# EAGLE design GEF-USB-B (EAGLE 6.4)
CHECKED: R. STARR; COMPANY: RTZ Audio; DATABASE: .\BOM\GEF-USB-PARTSDB.TXT; DATE: XX/XX/XX; DRAWN: R. STARR; DRGNO: ED-2XXX.100; REV: B
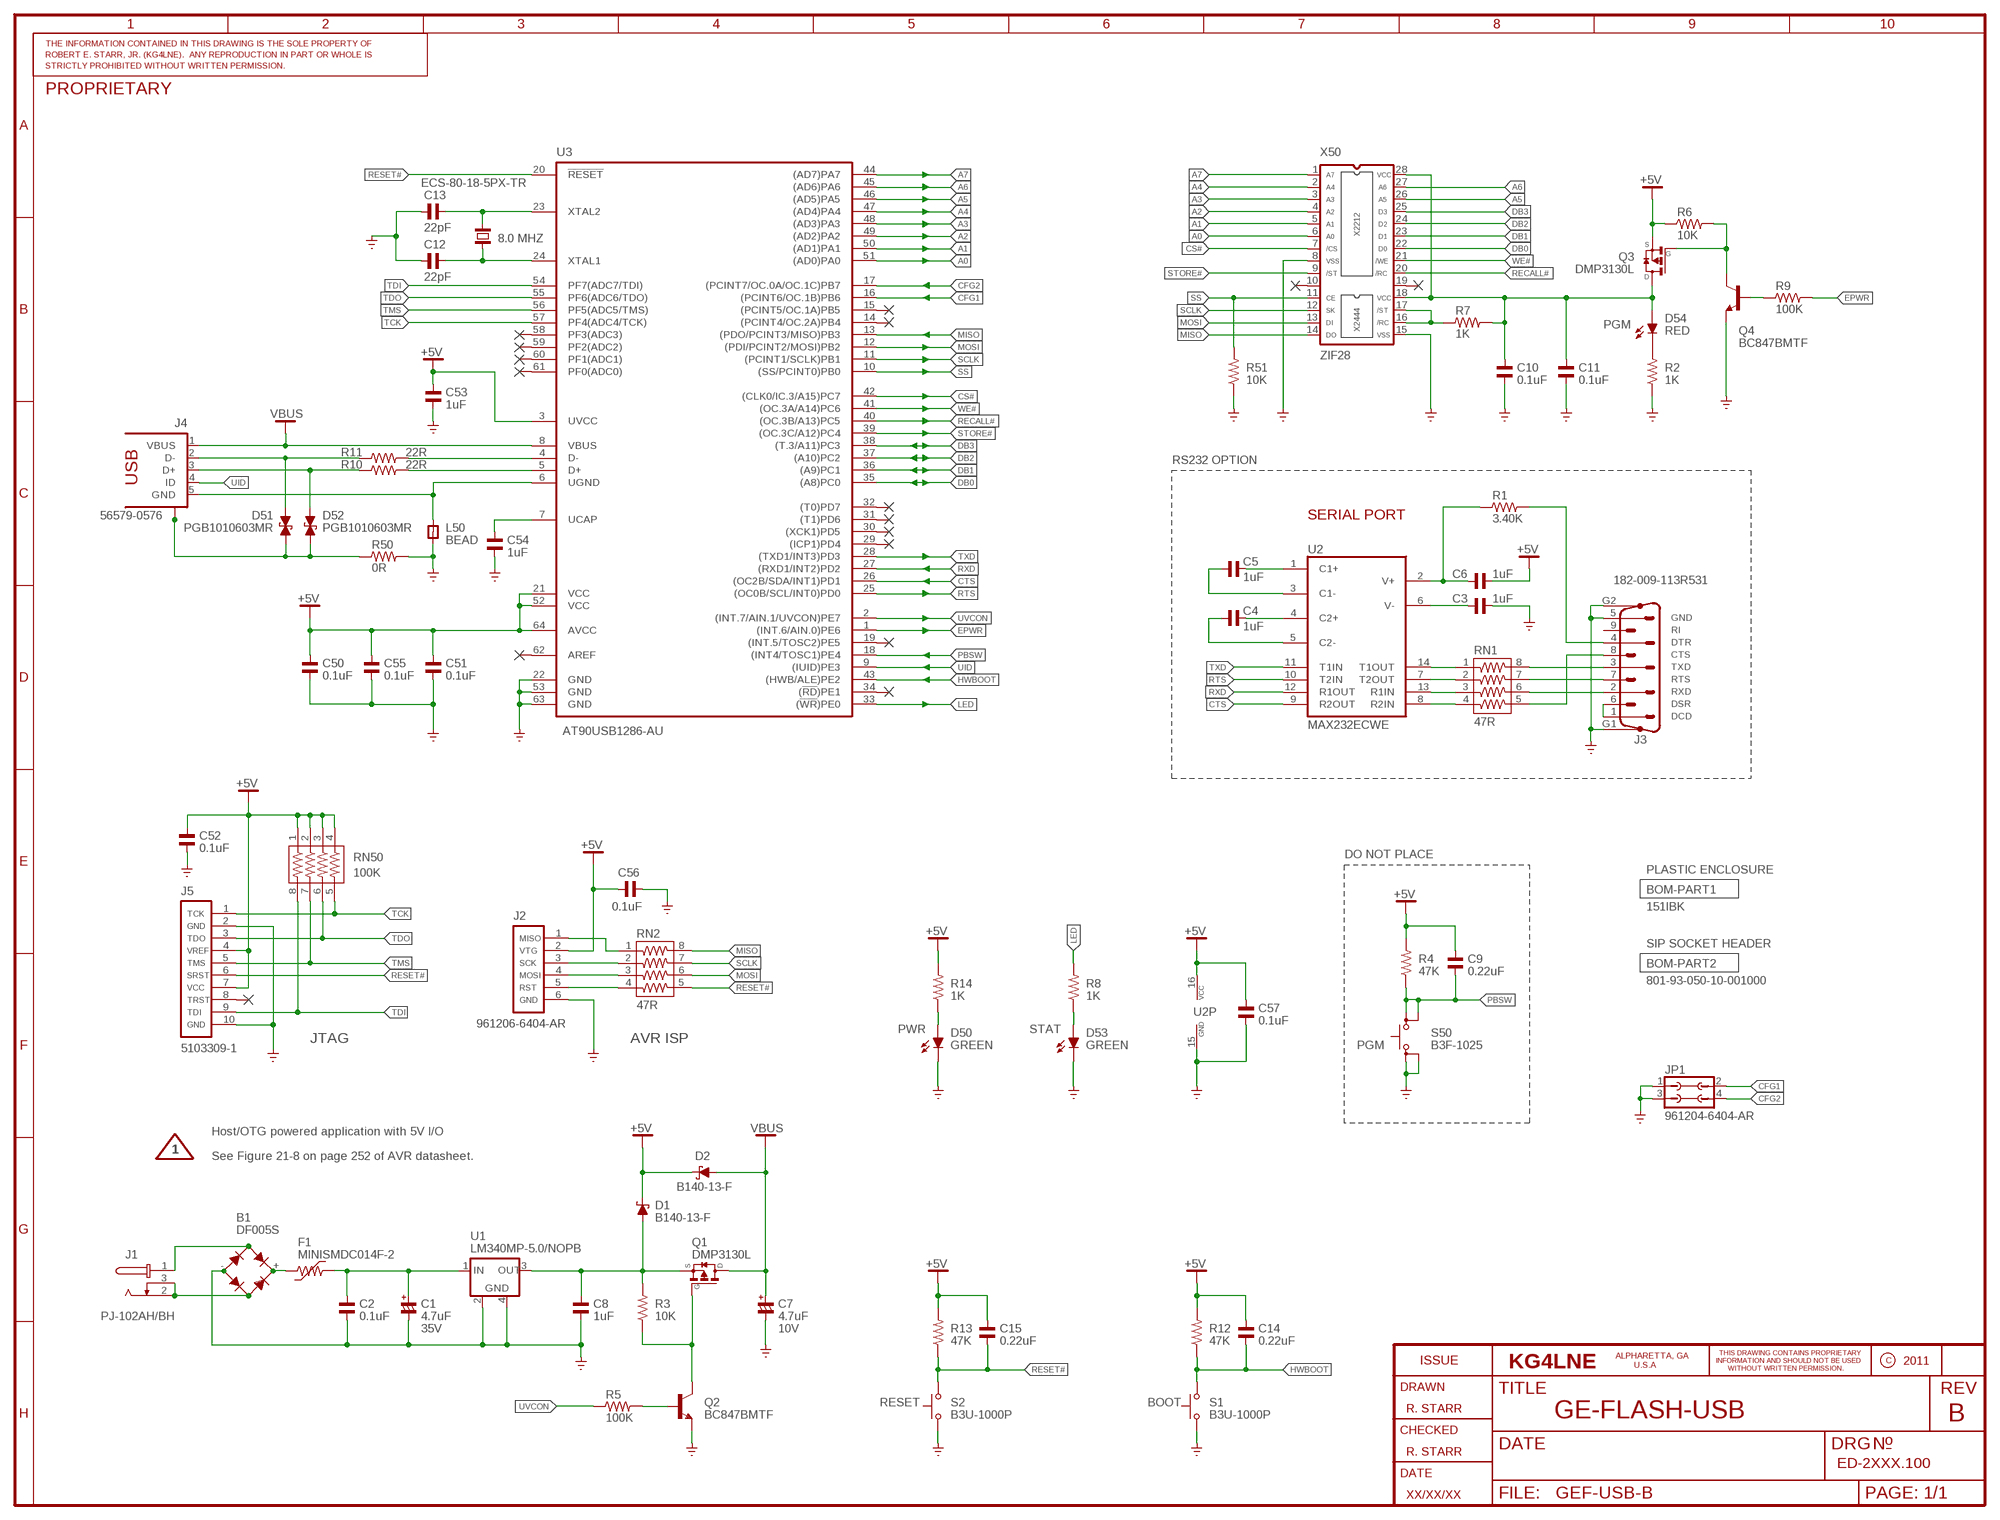
[diagram p0: schematic, sheet 1]
BOM-PART1 (BOM-PART): BOM: INCLUDE; DESC: PLASTIC ENCLOSURE; PARTNO: 151IBK; QTY: 1
BOM-PART2 (BOM-PART): BOM: INCLUDE; DESC: SIP SOCKET HEADER; PARTNO: 801-93-050-10-001000; QTY: 1
JMP1 (JUMP-Q): BOM: EXCLUDE; PARTNO: *
JMP2 (JUMP-Q): BOM: EXCLUDE; PARTNO: *

## Parts
B1  DF005S  DF-S  [DF-S]
C1  4.7uF  CP_7343  [C7343/T]
C2  0.1uF  C_0805  [C0805]
C3  1uF  C_0805  [C0805]
C4  1uF  C_0805  [C0805]
C5  1uF  C_0805  [C0805]
C6  1uF  C_0805  [C0805]
C7  4.7uF  CP_3528  [C3528/T]
C8  1uF  C_0805  [C0805]
C9  0.22uF  C_0805  [C0805]
C10  0.1uF  C_0805  [C0805]
C11  0.1uF  C_0805  [C0805]
C12  22pF  C_0805  [C0805]
C13  22pF  C_0805  [C0805]
C14  0.22uF  C_0805  [C0805]
C15  0.22uF  C_0805  [C0805]
C50  0.1uF  C_0805  [C0805]
C51  0.1uF  C_0805  [C0805]
C52  0.1uF  C_0805  [C0805]
C53  1uF  C_0805  [C0805]
C54  1uF  C_0805  [C0805]
C55  0.1uF  C_0805  [C0805]
C56  0.1uF  C_0805  [C0805]
C57  0.1uF  C_0805  [C0805]
D1  B140-13-F  DIODE-SCHOTTKY-SMA  [SMA]
D2  B140-13-F  DIODE-SCHOTTKY-SMA  [SMA]
D50  GREEN  LED3MM  [LED3MM]
D51  PGB1010603MR  PGB-0603  [PGB-0603]
D52  PGB1010603MR  PGB-0603  [PGB-0603]
D53  GREEN  LED3MM  [LED3MM]
D54  RED  LED3MM  [LED3MM]
F1  MINISMDC014F-2  POLYSWITCH-F1812  [F1812]
J1  PJ-102AH/BH  [PJ-102XH]
J2  961206-6404-AR  AVR-ISP6-MA03-2  [HDR-MA03-2]
J3  182-009-113R531  NC182M9-VS  [NC182M9]
J4  56579-0576  [56579-0576]
J5  5103309-1  AVR-JTAG10-5103309-1  [HDR-5103309-1]
JP1  961204-6404-AR  JP2Q  [JP2Q]
L50  BEAD  FB_0805  [L0805]
Q1  DMP3130L  [SOT23]
Q2  BC847BMTF  BC847BSMD  [SOT23]
Q3  DMP3130L  [SOT23]
Q4  BC847BMTF  BC847BSMD  [SOT23]
R1  3.40K  R_0805  [R0805]
R2  1K  R_0805  [R0805]
R3  10K  R_0805  [R0805]
R4  47K  R_0805  [R0805]
R5  100K  R_0805  [R0805]
R6  10K  R_0805  [R0805]
R7  1K  R_0805  [R0805]
R8  1K  R_0805  [R0805]
R9  100K  R_0805  [R0805]
R10  22R  R_0805  [R0805]
R11  22R  R_0805  [R0805]
R12  47K  R_0805  [R0805]
R13  47K  R_0805  [R0805]
R14  1K  R_0805  [R0805]
R50  0R  R_0805  [R0805]
R51  10K  R_0805  [R0805]
RN1  47R  744-8  [744-8]
RN2  47R  744-8  [744-8]
RN50  100K  744-8  [744-8]
S1  B3U-1000P  [B3U-1000P]
S2  B3U-1000P  [B3U-1000P]
S50  B3F-1025  10-XX-B  [B3F-10XX-B]
U1  LM340MP-5.0/NOPB  LM340MP-5.0  [SOT223]
U2  MAX232ECWE  [SO16W]
U3  AT90USB1286-AU  AT90USB646/647/1286/1287-MD  [TQFP64A]
X50  ZIF28  [ZIF28]
Y1  8.0 MHZ  CRYTALHC49UP  [HC49UP]

## Nets
+5V: C6.1 C9.2 C14.2 C15.2 C50.1 C51.2 C52.1 C53.2 C55.1 C56.2 C57.1 D1.C D2.C J2.2 J5.4 J5.7 Q3.2(S) R4.2 R6.1 R12.2 R13.2 R14.2 RN50.1 RN50.2 RN50.3 RN50.4 U2.16(VCC) U3.3(UVCC) U3.21(VCC) U3.52(VCC) U3.64(AVCC)
A0: U3.51((AD0)PA0) X50.6
A1: U3.50((AD1)PA1) X50.5
A2: U3.49((AD2)PA2) X50.4
A3: U3.48((AD3)PA3) X50.3
A4: U3.47((AD4)PA4) X50.2
A5: U3.46((AD5)PA5) X50.26
A6: U3.45((AD6)PA6) X50.27
A7: U3.44((AD7)PA7) X50.1
CFG1: JP1.2 U3.16((PCINT6/OC.1B)PB6)
CFG2: JP1.4 U3.17((PCINT7/OC.0A/OC.1C)PB7)
CS#: U3.42((CLK0/IC.3/A15)PC7) X50.7
CTS: U2.9(R2OUT) U3.26((OC2B/SDA/INT1)PD1)
DB0: U3.35((A8)PC0) X50.22
DB1: U3.36((A9)PC1) X50.23
DB2: U3.37((A10)PC2) X50.24
DB3: U3.38((T.3/A11)PC3) X50.25
EPWR: R9.2 U3.1((INT.6/AIN.0)PE6)
GND: B1.- C1.- C2.1 C3.1 C7.- C8.2 C10.1 C11.1 C12.1 C13.1 C50.2 C51.1 C52.2 C53.1 C54.1 C55.2 C56.1 C57.2 D50.K(C) D53.K(C) J2.6 J3.5 J3.G1 J3.G2 J5.2 J5.10 JP1.1 JP1.3 L50.1 Q2.2(E) Q4.2(E) R2.1 R50.2 R51.1 S1.1(P) S2.1(P) S50.3(P) S50.4(P1) U1.2(GND) U1.4(GND1) U2.15(GND) U3.22(GND) U3.53(GND) U3.63(GND) X50.8 X50.15 ; supply symbol labelled GND_
HWBOOT: C14.1 R12.1 S1.2(S) U3.43((HWB/ALE)PE2)
LED: R8.2 U3.33((!WR!)PE0)
MISO: RN2.8 U3.13((PDO/PCINT3/MISO)PB3) X50.14
MOSI: RN2.6 U3.12((PDI/PCINT2/MOSI)PB2) X50.13
N$1: J2.5 RN2.4
N$2: B1.AC2(A2) J1.2(S) J1.3(SS)
N$3: R10.2 U3.5(D+)
N$4: D52.2 J4.3(D+) R10.1
N$5: R11.2 U3.4(D-)
N$6: D51.2 J4.2(D-) R11.1
N$7: C54.2 U3.7(UCAP)
N$8: D50.A R14.1
N$9: D51.1 D52.1 J4.S1 J4.S2 J4.S3 J4.S4 R50.1
N$10: D53.A R8.1
N$11: Q1.1(G) Q2.3(C) R3.1
N$12: Q2.1(B) R5.2
N$14: Q3.1(G) Q4.3(C) R6.2
N$15: C10.2 C11.2 D54.A Q3.3(D) R7.2 X50.18 X50.28
N$17: D54.K(C) R2.2
N$18: J4.5(GND) L50.2 U3.6(UGND)
N$19: J3.1 J3.6
N$20: C1.+ C2.2 F1.2 U1.1(IN)
N$21: C8.1 D1.A Q1.2(S) R3.2 U1.3(OUT)
N$22: J3.2 RN1.6
N$23: B1.+ F1.1
N$24: B1.AC1(A1) J1.1(T)
N$25: Q4.1(B) R9.1
N$30: C12.2 U3.24(XTAL1) Y1.1
N$31: J3.7 RN1.7
N$34: C3.2 U2.6(V-)
N$36: C6.2 R1.1 U2.2(V+)
N$38: C13.2 U3.23(XTAL2) Y1.2
N$39: C4.1 U2.4(C2+)
N$44: C5.1 U2.1(C1+)
N$45: C4.2 U2.5(C2-)
N$46: C5.2 U2.3(C1-)
N$51: J3.8 RN1.5
N$71: J3.3 RN1.8
N$74: RN1.3 U2.13(R1IN)
N$75: RN1.1 U2.14(T1OUT)
N$101: RN1.4 U2.8(R2IN)
N$103: J3.4 R1.2
N$104: RN1.2 U2.7(T2OUT)
N$105: J2.1 RN2.1
N$107: J2.3 RN2.2
N$108: J2.4 RN2.3
PBSW: C9.1 R4.1 S50.1(S) S50.2(S1) U3.18((INT4/TOSC1)PE4)
PU2: R7.1 X50.16 X50.17
RECALL#: U3.40((OC.3B/A13)PC5) X50.20
RESET#: C15.1 J5.6 R13.1 RN2.5 S2.2(S) U3.20(!RESET!)
RTS: U2.10(T2IN) U3.25((OC0B/SCL/INT0)PD0)
RXD: U2.12(R1OUT) U3.27((RXD1/INT2)PD2)
SCLK: RN2.7 U3.11((PCINT1/SCLK)PB1) X50.12
SS: R51.2 U3.10((SS/PCINT0)PB0) X50.11
STORE#: U3.39((OC.3C/A12)PC4) X50.9
TCK: J5.1 RN50.5 U3.57(PF4(ADC4/TCK))
TDI: J5.9 RN50.8 U3.54(PF7(ADC7/TDI))
TDO: J5.3 RN50.6 U3.55(PF6(ADC6/TDO))
TMS: J5.5 RN50.7 U3.56(PF5(ADC5/TMS))
TXD: U2.11(T1IN) U3.28((TXD1/INT3)PD3)
UID: J4.4(ID) U3.9((IUID)PE3)
UVCON: R5.1 U3.2((INT.7/AIN.1/UVCON)PE7)
VBUS: C7.+ D2.A J4.1(VBUS) Q1.3(D) U3.8(VBUS)
WE#: U3.41((OC.3A/A14)PC6) X50.21
Unconnected: J3.9 J5.8 U3.14((PCINT4/OC.2A)PB4) U3.15((PCINT5/OC.1A)PB5) U3.19((INT.5/TOSC2)PE5) U3.29((ICP1)PD4) U3.30((XCK1)PD5) U3.31((T1)PD6) U3.32((T0)PD7) U3.34((!RD!)PE1) U3.58(PF3(ADC3)) U3.59(PF2(ADC2)) U3.60(PF1(ADC1)) U3.61(PF0(ADC0)) U3.62(AREF) X50.10 X50.19

## Notes on the sheet
- A7 | VCC
- A4 | A6
- A3 | A5
- A2 | D3
- A1 | D2
- X2212
- A0 | D1
- /CS | D0
- VSS | /WE
- /ST | /RC
- CE | VCC
- SK | /ST
- DI | /RC
- X2444
- DO | VSS
- RS232 OPTION
- SERIAL PORT
- GND
- RI
- DTR
- CTS
- TXD
- RTS
- RXD
- DSR
- DCD
- DO NOT PLACE
- JTAG | AVR ISP
- Host/OTG powered application with 5V I/O
- See Figure 21-8 on page 252 of AVR datasheet.
- GE-FLASH-USB

## Library data of the parts
B1 = rectifier:DF-S: RECTIFIER DF005S - DF10S, Diodes Inc.; PARTNO: DF005S
C1 = rc-master:CP_: POLARIZED CAP; PARTNO: TAJD475M035RNJ; VOLT: 35V
C2 C10 C11 C50-C52 C55-C57 = rc-master:C_: NON-POLARIZED CAP; PARTNO: GCM21BR72A104KA37L
C3-C6 C8 C53 C54 = rc-master:C_: NON-POLARIZED CAP; PARTNO: GCM21BR71E105KA56L
C7 = rc-master:CP_: POLARIZED CAP; PARTNO: TAJB475K010RNJ; VOLT: 10V
C9 = rc-master:C_: NON-POLARIZED CAP; DNP: T; PARTNO: GCM21BR71H224KA37L
C12 C13 = rc-master:C_: NON-POLARIZED CAP; PARTNO: GRM2195C2A220JZ01D
C14 C15 = rc-master:C_: NON-POLARIZED CAP; PARTNO: GCM21BR71H224KA37L
D1 D2 = diode:DIODE-SCHOTTKY-: SCHOTTKY DIODE; PARTNO: B140-13-F
D50 = LED:LED: LED Various Types; LABEL: PWR; PARTNO: TLHG4405
D51 D52 = diode:PGB-0603: ESD SUPPRESSOR; PARTNO: PGB1010603MR
D53 = LED:LED: LED Various Types; LABEL: STAT; PARTNO: TLHG4405
D54 = LED:LED: LED Various Types; LABEL: PGM; PARTNO: TLHR4405
F1 = fuse:POLYSWITCH: POLYSWITCH Polyswitch Resetable Fuses; PARTNO: MINISMDC014F-2
J1 = con-cuistack:PJ-102AH/BH: DC Power Jack PJ-102AH (2.1 x 5.5 MM) PJ-102BH (2.5 x 5.5 MM); PARTNO: PJ-102AH
J2 = atmel-avr:AVR-ISP6-: AVR ISP-6 Serial Programming Header; PARTNO: 961206-6404-AR
J3 = con-subd:NC182M9-VS: SUB-D MALE - NorComp; PARTNO: 182-009-113R531
J4 = con-usb:56579-0576: USB - OTG, miniUSB Type AB, Molex; PARTNO: 56579-0576
J5 = atmel-avr:AVR-JTAG10-: AVR JTAG Debug/Programming Header; PARTNO: 5103309-1
JP1 = jumper:JP2Q: JUMPER; PARTNO: 961204-6404-AR
L50 = rc-master:FB_: FERRITE BEAD; PARTNO: BLM21PG221SN1D
Q1 Q3 = transistor-fet:DMP3130L: P-CHANNEL ENHANCEMENT MODE MOSFET; PARTNO: DMP3130L
Q2 Q4 = transistor-npn:BC847*: NPN Transistor; PARTNO: BC847BMTF
R1 = rc-master:R_: RESISTOR; PARTNO: ERJ-6ENF3401V
R2 R7 R8 R14 = rc-master:R_: RESISTOR; PARTNO: ERJ-6ENF1001V
R3 R6 R51 = rc-master:R_: RESISTOR; PARTNO: ERJ-6ENF1022V
R4 = rc-master:R_: RESISTOR; DNP: T; PARTNO: ERJ-6ENF4702V
R5 R9 = rc-master:R_: RESISTOR; PARTNO: ERJ-6ENF1003V
R10 R11 = rc-master:R_: RESISTOR; PARTNO: ERJ-6ENF22R1V
R12 R13 = rc-master:R_: RESISTOR; PARTNO: ERJ-6ENF4702V
R50 = rc-master:R_: RESISTOR; PARTNO: ERJ-6GEY0R00V
RN1 RN2 = resistor-array:744-8: CTS 744 Series 4 Resistors, 8 Terminations; PARTNO: 744C083470JTR
RN50 = resistor-array:744-8: CTS 744 Series 4 Resistors, 8 Terminations; PARTNO: 744C083104JPTR
S1 = switch-omron:B3U-1000P: SMD Tactile Switch - Ultra Small; LABEL: BOOT; PARTNO: B3U-1000P
S2 = switch-omron:B3U-1000P: SMD Tactile Switch - Ultra Small; LABEL: RESET; PARTNO: B3U-1000P
S50 = switch-omron:10-XX: OMRON SWITCH; DNP: T; LABEL: PGM; PARTNO: B3F-1025
U1 = v-reg:LM340MP-5.0: VOLTAGE REGULATOR; PARTNO: LM340MP-5.0/NOPB
U2 = maxim:MAX232ECWE: RS232 TRANSEIVER; PARTNO: MAX232ECWE+
U3 = atmel-avr:AT90USB646/647/1286/1287: MICROCONTROLLER 64/128K Bytes of ISP Flash and USB Controller; PARTNO: AT90USB1286-AU
X50 = CUSTOM:ZIF28: ZIF Socket - 28 Pin; PARTNO: 28-6554-11
Y1 = crystal:CRYTAL: CRYSTAL; PARTNO: ECS-80-18-5PX-TR

## Net classes
0 default: width 0.178 mm, clearance 0.178 mm

## Board
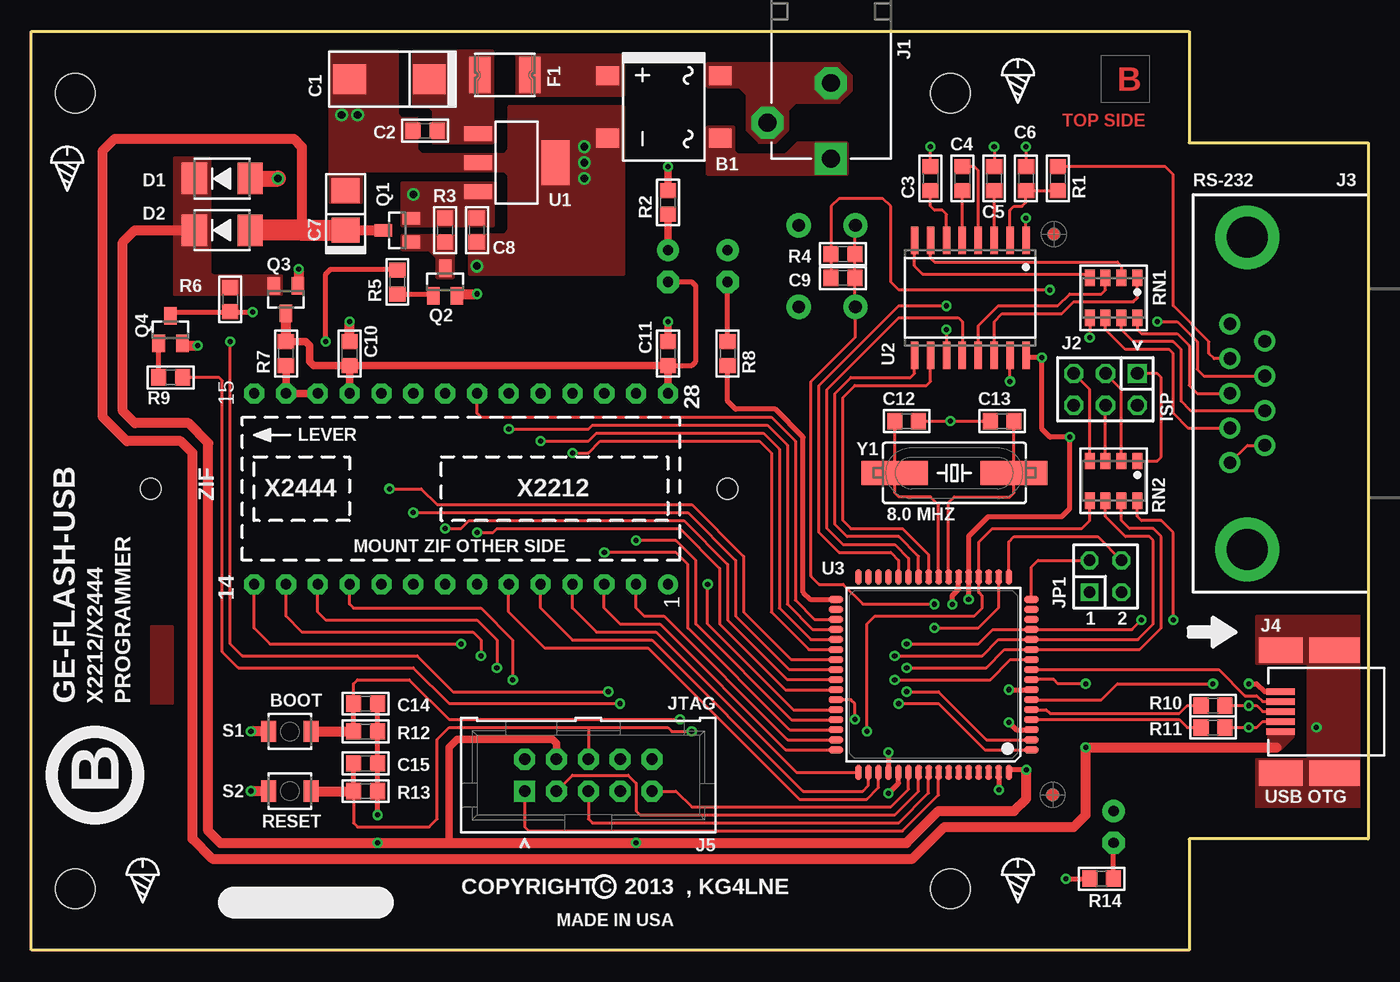
[diagram p1: board, top side]
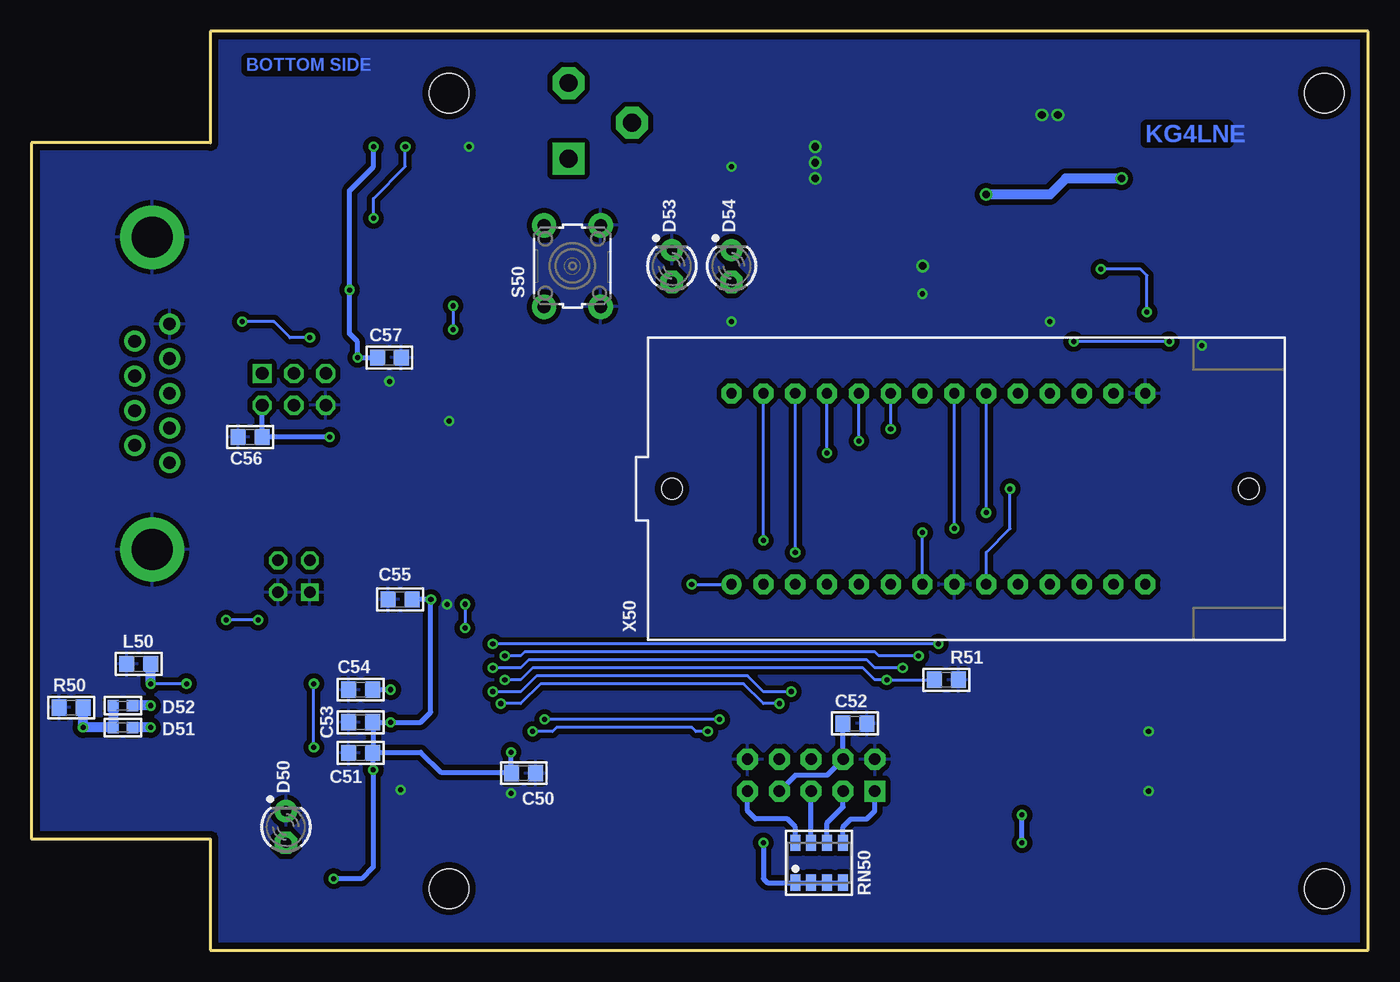
[diagram p2: board, bottom side, seen from below]

Size 106.68 x 73.34 mm. Coordinates in mm from the lower left corner, seen from the top.
Outline: 92.39,73.34 92.39,64.45 106.68,64.45 106.68,8.89 92.39,8.89 92.39,0 0,0 0,73.34 92.39,73.34
Copper layers (1*16): Top 0.035mm / dielectric 1.5mm / Bottom 0.035mm
Design rules "default *": minimum track width 7mil, minimum drill 16mil, track to track 8mil, track to pad 8mil, pad to pad 8mil, via to via 8mil, smd to smd 8mil, copper to edge 20mil, drill to drill 8mil, minimum pad ring 10mil, minimum via ring 8mil, stop-mask expansion 4mil, vias tented up to drill 24mil, thermal gap 16mil
Holes 3.17 mm at 73.34,4.92 3.49,68.42 3.49,4.92 73.34,68.42 147.37,14.86
Holes 0.41 mm at 147.37,50.42
Holes 0.61 mm at 147.37,45.34
Holes 0.81 mm at 147.37,40.26
Holes 0.91 mm at 147.37,35.18
Holes 1.02 mm at 147.37,30.1
Holes 1.42 mm at 147.37,25.02
Holes 1.68 mm at 147.37,19.94
Holes 3.25 mm at 147.37,9.78
Milling: 8 lines

### Footprints (pad centres in the part's own frame; a part is rotated, then mirrored left to right if it is on the bottom)
DF-S = smd 1.5 x 1.8: + -2.5,-4.5; - 2.5,-4.5; AC1 2.5,4.5; AC2 -2.5,4.5
C7343/T = smd 2.6 x 2.4: + 3.175,0; - -3.175,0
C0805 = smd 1.2 x 1.3: 1 -0.953,0; 2 0.953,0
C3528/T = smd 2 x 2.2: + 1.587,0; - -1.587,0
SMA = smd 2 x 2.5: A 2.223,0; C -2.223,0
LED3MM = drill 0.813 pad 1.778 octagon: A -1.27,0 | drill 0.813 pad 1.778: K 1.27,0
PGB-0603 = smd 0.9 x 0.9: 1 -0.762,0; 2 0.762,0
F1812 = smd 1.7 x 2.9: 1 -2,0; 2 2,0
PJ-102XH = drill 1.422 pad 2.54 square: 1 0,0 | drill 1.422 pad 2.54 octagon: 2 0,-6.032; 3 5.08,-2.857
HDR-MA03-2 = drill 1.016 square: 1 -2.54,-1.27 | drill 1.016 octagon: 2 -2.54,1.27; 3 0,-1.27; 4 0,1.27; 5 2.54,-1.27; 6 2.54,1.27
NC182M9 = drill 1.016 pad 1.676: 1 -5.537,2.769; 2 -2.769,2.769; 3 0,2.769; 4 2.769,2.769; 5 5.537,2.769; 6 -4.153,0; 7 -1.384,0; 8 1.384,0; 9 4.153,0 | drill 3.251 pad 5.08: G1 12.459,1.384; G2 -12.459,1.384
56579-0576 = smd 0.5 x 2.25: 1 1.6,0; 2 0.8,0; 3 0,0; 4 -0.8,0; 5 -1.6,0 | smd 2.05 x 3.5: S1 -4.9,0; S2 4.9,0 | smd 2.05 x 4: S3 -4.9,4.3; S4 4.9,4.3
HDR-5103309-1 = drill 0.914 pad 1.676 square: 1 -5.08,-1.27 | drill 0.914 pad 1.676 octagon: 2 -5.08,1.27; 3 -2.54,-1.27; 4 -2.54,1.27; 5 0,-1.27; 6 0,1.27; 7 2.54,-1.27; 8 2.54,1.27; 9 5.08,-1.27; 10 5.08,1.27
JP2Q = drill 0.914 square: 1 -1.27,-1.27 | drill 0.914 octagon: 2 -1.27,1.27; 3 1.27,-1.27; 4 1.27,1.27
L0805 = smd 1.2 x 1.3: 1 -0.953,0; 2 0.953,0
SOT23 = smd 1 x 1.4: 1 -0.95,-1.1; 2 0.95,-1.1; 3 0,1.1
R0805 = smd 1.2 x 1.3: 1 -0.953,0; 2 0.953,0
744-8 = smd 0.8 x 1.3: 1 -1.905,-1.587; 2 -0.635,-1.587; 3 0.635,-1.587; 4 1.905,-1.587; 5 1.905,1.587; 6 0.635,1.587; 7 -0.635,1.587; 8 -1.905,1.587
B3U-1000P = smd 1.2 x 1.7: 1 -1.7,0; 2 1.7,0
B3F-10XX-B = drill 1.016 pad 1.93: 1 -3.251,2.261; 2 3.251,2.261; 3 -3.251,-2.261; 4 3.251,-2.261
SOT223 = smd 1.219 x 2.235: 1 -2.311,-3.099; 2 0,-3.099; 3 2.311,-3.099 | smd 3.6 x 2.2: 4 0,3.099
SO16W = smd 0.6 x 2.2: 1 -4.445,-4.6; 2 -3.175,-4.6; 3 -1.905,-4.6; 4 -0.635,-4.6; 5 0.635,-4.6; 6 1.905,-4.6; 7 3.175,-4.6; 8 4.445,-4.6; 9 4.445,4.6; 10 3.175,4.6; 11 1.905,4.6; 12 0.635,4.6; 13 -0.635,4.6; 14 -1.905,4.6; 15 -3.175,4.6; 16 -4.445,4.6
TQFP64A = smd 1.194 x 0.559: 1 -7.8,6; 2 -7.8,5.2; 3 -7.8,4.4; 4 -7.8,3.6; 5 -7.8,2.8; 6 -7.8,2; 7 -7.8,1.2; 8 -7.8,0.4; 9 -7.8,-0.4; 10 -7.8,-1.2; 11 -7.8,-2; 12 -7.8,-2.8; 13 -7.8,-3.6; 14 -7.8,-4.4; 15 -7.8,-5.2; 16 -7.8,-6; 33 7.8,-6; 34 7.8,-5.2; 35 7.8,-4.4; 36 7.8,-3.6; 37 7.8,-2.8; 38 7.8,-2; 39 7.8,-1.2; 40 7.8,-0.4; 41 7.8,0.4; 42 7.8,1.2; 43 7.8,2; 44 7.8,2.8; 45 7.8,3.6; 46 7.8,4.4; 47 7.8,5.2; 48 7.8,6 | smd 0.559 x 1.194: 17 -6,-7.8; 18 -5.2,-7.8; 19 -4.4,-7.8; 20 -3.6,-7.8; 21 -2.8,-7.8; 22 -2,-7.8; 23 -1.2,-7.8; 24 -0.4,-7.8; 25 0.4,-7.8; 26 1.2,-7.8; 27 2,-7.8; 28 2.8,-7.8; 29 3.6,-7.8; 30 4.4,-7.8; 31 5.2,-7.8; 32 6,-7.8; 49 6,7.8; 50 5.2,7.8; 51 4.4,7.8; 52 3.6,7.8; 53 2.8,7.8; 54 2,7.8; 55 1.2,7.8; 56 0.4,7.8; 57 -0.4,7.8; 58 -1.2,7.8; 59 -2,7.8; 60 -2.8,7.8; 61 -3.6,7.8; 62 -4.4,7.8; 63 -5.2,7.8; 64 -6,7.8
ZIF28 = drill 0.813 pad 1.6: 1 -16.51,-7.62 | drill 0.813 pad 1.6 octagon: 2 -13.97,-7.62; 3 -11.43,-7.62; 4 -8.89,-7.62; 5 -6.35,-7.62; 6 -3.81,-7.62; 7 -1.27,-7.62; 8 1.27,-7.62; 9 3.81,-7.62; 10 6.35,-7.62; 11 8.89,-7.62; 12 11.43,-7.62; 13 13.97,-7.62; 14 16.51,-7.62; 15 16.51,7.62; 16 13.97,7.62; 17 11.43,7.62; 18 8.89,7.62; 19 6.35,7.62; 20 3.81,7.62; 21 1.27,7.62; 22 -1.27,7.62; 23 -3.81,7.62; 24 -6.35,7.62; 25 -8.89,7.62; 26 -11.43,7.62; 27 -13.97,7.62; 28 -16.51,7.62 | hole 1.676: -21.273,0; 24.765,0
HC49UP = smd 5.334 x 1.93: 1 -4.763,0; 2 4.763,0

### Placement (x,y rotation side)
B1  50.48,67.31 270 top
C1  28.57,69.53 0 top
C2  31.43,65.41 0 top
C3  71.75,61.59 270 top
C4  74.3,61.59 270 top
C5  76.83,61.59 270 top
C6  79.38,61.59 270 top
C7  25.08,59.05 270 top
C8  35.56,57.47 270 top
C9  64.77,53.66 180 top
C10  25.4,47.62 270 top
C11  50.8,47.62 270 top
C12  69.85,42.23 180 top
C13  77.47,42.23 0 top
C14  26.67,19.68 0 top
C15  26.67,14.92 0 top
C50  67.39,14.14 0 bottom
C51  80.4,15.75 0 bottom
C52  40.96,18.1 0 bottom
C53  80.4,18.2 0 bottom
C54  80.4,20.8 0 bottom
C55  77.25,28 180 bottom
C56  89.22,40.96 0 bottom
C57  78.11,47.31 0 bottom
D1  15.24,61.59 0 top
D2  15.24,57.47 0 top
D50  86.36,9.84 90 bottom
D51  99.38,17.78 0 bottom
D52  99.38,19.53 0 bottom
D53  55.56,54.61 90 bottom
D54  50.8,54.61 90 bottom
F1  37.78,69.85 180 top
FABFRAME1  [FAB_FRAME_ANSI-A]  -30.48,-97.16 0 top  (outside the outline)
FABFRAME2  [FAB_DOCFIELD_GENERIC]  124.46,-97.16 0 top  (outside the outline)
FEAT1  [ICON_SCREW-S]  78.74,69.85 0 top
FEAT2  [PCBFEAT-MREV-076]  87.31,69.53 0 top
FEAT3  [ICON_SCREW-S]  2.86,62.87 0 top
FEAT4  [G10]  81.6,57.15 0 top
FEAT5  [ICON_PIN1_A]  88.27,47.94 90 top
FEAT6  [ICON_ARROW-S]  94.3,25.4 270 top
FEAT7  [PCBFEAT-DATECODE-050R]  11.05,19.94 90 top
FEAT8  [PCBFEAT-REV-150]  5.08,13.97 90 top
FEAT9  [G10]  81.5,12.4 0 top
FEAT10  [ICON_PIN1_A]  39.37,8.89 270 top
FEAT11  [ICON_SCREW-S]  8.89,6.03 0 top
FEAT12  [ICON_SCREW-S]  78.74,6.03 0 top
FEAT13  [PCBFEAT-COPYRIGHT-050]  34.29,4.45 0 top
FEAT14  [FIELD_SCRIBBLE-1]  21.91,3.81 0 top
J1  63.82,63.18 180 top
J2  85.72,44.77 180 top
J3  98.42,44.45 90 top
J4  99.69,19.05 270 top
J5  44.45,13.97 0 top
JP1  85.72,29.84 0 top
L50  98.11,22.86 0 bottom
Q1  29.21,57.47 90 top
Q2  33.02,53.34 0 top
Q3  20.32,51.94 180 top
Q4  11.11,49.53 0 top
R1  81.92,61.59 90 top
R2  50.8,59.69 270 top
R3  33.02,57.47 90 top
R4  64.77,55.56 180 top
R5  29.21,53.34 270 top
R6  15.88,51.94 270 top
R7  20.32,47.62 90 top
R8  55.56,47.62 270 top
R9  11.11,45.72 0 top
R10  94.3,19.53 180 top
R11  94.3,17.78 180 top
R12  26.67,17.46 0 top
R13  26.67,12.7 0 top
R14  85.41,5.71 180 top
R50  103.5,19.37 180 bottom
R51  33.66,21.59 180 bottom
RN1  86.36,52.07 180 top
RN2  86.36,37.47 180 top
RN50  43.81,6.99 0 bottom
S1  20.64,17.46 0 top
S2  20.64,12.7 0 top
S50  63.5,54.61 90 bottom
U1  38.73,62.87 270 top
U2  74.93,52.07 180 top
U3  72,22 180 top
X50  34.29,36.83 0 bottom
Y1  73.66,38.1 0 top

### Tracks (layer width: path | path; a pad name or v marks a point on that pad's centre or on a via)
+5V  (via drill 0.41)
  Top 0.254: U3.64 78,13.97 | v79.38,64.14 C6.1 | v81.28,52.7 69.22,52.7 68.58,53.34 68.58,59.37 67.94,60.01 64.45,60.01 63.82,59.37 R4.2 C9.2
  Top 0.406: v78,18.2 78.6,17.6 U3.3 | v74.8,28 U3.21 74.8,33.05 76.36,34.61 82.23,34.61 82.87,35.24 v82.87,40.96 81.28,40.96 80.64,41.59 v80.64,47.31 79.38,47.31 U2.16 | v68.4,15.8 U3.52 | v79.4,14.4 78,14.4 U3.64 | C14.2 R12.2 C15.2 R13.2 v27.62,10.79 | v82.55,5.71 R14.2
  Top 0.61: J5.4 41.91,16.51 41.59,16.83 33.97,16.83 33.34,16.19 33.34,8.57
  Top 0.813: v79.4,14.4 79.4,12.09 78.42,11.11 72.39,11.11 69.85,8.57 v48.26,8.57 33.34,8.57 v27.62,8.57 15.08,8.57 14.13,9.53 14.13,40.48 12.54,42.07 8.26,42.07 7.3,43.02 7.3,56.52 8.26,57.47 D2.C
  Bottom 0.406: C55.1 v74.8,28 74.8,19 75.6,18.2 v78,18.2 C53.2 79.38,18.2 79.38,15.75 C51.2 | C51.2 79.4,15.75 v79.4,14.4 79.4,6.64 80.33,5.71 v82.55,5.71 | C52.1 J5.4 43.18,13.97 45.72,13.97 J5.7 | C57.1 v80.64,47.31 80.64,48.58 81.28,49.21 v81.28,52.7 81.28,60.64 C6.1 v79.38,64.14 | J2.2 C56.2 v82.87,40.96 | C51.2 79.45,15.8 75.6,15.8 74,14.2 U3.52 | C50.1 68.4,14.14 U3.52 | U3.52 v68.4,15.8 | RN50.4 RN50.3 RN50.2 RN50.1 47.94,5.4 48.26,5.71 v48.26,8.57 | v27.62,8.57 v27.62,10.79
  pour Top (isolate 0.406, no thermals): 11.43,63.25 14.22,63.25 14.22,54.1 14.48,53.85 19.94,53.85 19.94,52.32 11.43,52.32
A0
  Top 0.254: U3.51 67.6,12.99 66.67,12.06 61.28,12.06 49.21,24.13 40.96,24.13 38.1,26.99 X50.6
A1
  Top 0.254: U3.50 66.8,13.14 66.36,12.7 61.59,12.7 49.53,24.77 43.18,24.77 40.64,27.3 X50.5
A2
  Top 0.254: U3.49 61.05,14.2 49.85,25.4 45.09,25.4 43.18,27.3 X50.4
A3
  Top 0.254: U3.48 60.2,16 50.16,26.04 46.99,26.04 45.72,27.3 X50.3
A4
  Top 0.254: U3.47 60.35,16.8 50.48,26.67 48.9,26.67 48.26,27.3 X50.2
A5  (via drill 0.41)
  Top 0.254: U3.46 60.51,17.6 52.39,25.72 52.39,30.8 51.44,31.75 v45.72,31.75
  Bottom 0.254: v45.72,31.75 X50.26
A6  (via drill 0.41)
  Top 0.254: U3.45 60.66,18.4 53.02,26.04 53.02,31.11 51.44,32.7 v48.26,32.7
  Bottom 0.254: v48.26,32.7 X50.27
A7  (via drill 0.41)
  Top 0.254: U3.44 60.81,19.2 53.98,26.04 v53.98,29.21
  Bottom 0.254: v53.98,29.21 X50.1
CFG1
  Top 0.254: U3.16 79.8,30.59 80.33,31.11 JP1.2
CFG2
  Top 0.254: JP1.4 85.09,33.02 78.42,33.02 78,32.6 U3.17
CS#  (via drill 0.41)
  Top 0.254: U3.42 60.16,20.8 54.93,26.04 54.93,30.48 51.75,33.66 37.15,33.66 36.83,33.34 v35.56,33.34
  Bottom 0.254: X50.7 v35.56,33.34
CTS
  Top 0.254: U3.26 70.8,31.43 69.22,33.02 65.09,33.02 64.14,33.97 64.14,44.45 65.41,45.72 70.17,45.72 70.48,46.04 U2.9
DB0
  Top 0.254: U3.35 62.5,26.4 60.96,27.94 60.96,40.64 59.05,42.55 35.88,42.55 35.56,42.86 X50.22
DB1  (via drill 0.41)
  Top 0.254: U3.36 62.35,25.6 60.33,27.62 60.33,40.32 58.74,41.91 44.77,41.91 44.45,41.59 v38.1,41.59
  Bottom 0.254: v38.1,41.59 X50.23
DB2  (via drill 0.41)
  Top 0.254: U3.37 62.2,24.8 59.69,27.3 59.69,40.01 58.42,41.27 45.09,41.27 44.45,40.64 v40.64,40.64
  Bottom 0.254: v40.64,40.64 X50.24
DB3  (via drill 0.41)
  Top 0.254: U3.38 62.04,24 59.05,26.99 59.05,39.69 58.1,40.64 45.4,40.64 44.45,39.69 v43.18,39.69
  Bottom 0.254: v43.18,39.69 X50.25
EPWR  (via drill 0.41)
  Top 0.254: U3.1 76.08,16 72.39,19.68 v69.22,19.68 | v46.99,19.68 33.34,19.68 30.48,22.54 16.51,22.54 15.24,23.81 15.24,45.47 14.99,45.72 R9.2
  Bottom 0.254: v69.22,19.68 67.63,19.68 66.04,21.27 49.85,21.27 48.26,19.68 v46.99,19.68
GND  (via drill 0.41, 0.61)
  Top 0.254: v78.11,45.4 U2.15 | C3.1 v71.75,64.14 | C13.1 v73.34,42.23 C12.1
  Top 0.406: U3.22 74,28.8 73.5,28.3 v73.5,27.6 | v68.4,12.54 69.2,13.34 U3.53 | U3.63 v77.2,12.8
  Top 0.61: C11.1 v50.8,50.16 | R2.1 v50.8,62.55
  Top 0.813: C10.1 v25.4,50.16 | S2.1 v17.53,12.7 | S1.1 v17.53,17.46 | Q2.2 33.97,52.39 v35.56,52.39 | Q4.2 12.06,48.26 v13.27,48.26
  other vias: 35.56,54.61 24.77,66.67 26.04,66.67 44.13,62.87 44.13,61.59 44.13,64.14
  pour Bottom (isolate 0.406): 0.64,72.71 8.57,72.71 19.68,72.71 91.76,72.71 91.76,63.82 106.05,63.82 106.05,9.53 91.76,9.53 91.76,0.64 0.64,0.64
  pour Top (isolate 0.406, no thermals): 23.81,71.75 23.81,59.69 26.35,59.69 26.35,61.91 26.67,62.23 37.72,62.23 38.1,61.85 38.1,57.47 37.72,57.09 34.92,57.09 34.92,53.98 47.31,53.98 47.31,67.31 38.1,67.31 38.1,63.88 37.72,63.5 31.18,63.5 30.8,63.88 30.8,66.36 29.53,66.36 29.21,66.67 29.21,71.75
HWBOOT  (via drill 0.41)
  Top 0.254: U3.43 65.41,20 65.72,19.68 v65.72,18.41 | v51.75,18.41 33.34,18.41 30.16,21.59 26.04,21.59 25.72,21.27 C14.1
  Top 0.406: R12.1 C14.1
  Top 0.813: S1.2 R12.1
  Bottom 0.254: v51.75,18.41 v65.72,18.41
LED
  Top 0.406: U3.33 62.17,28 61.59,28.57 61.59,40.96 59.37,43.18 56.2,43.18 55.56,43.81 R8.2
MISO  (via drill 0.41)
  Top 0.254: v88.58,26.35 87.83,25.6 U3.13 76.72,25.6 75.56,24.45 v69.85,24.45 | v91.12,26.35 91.12,33.34 90.17,34.29 88.58,34.29 88.27,34.61 RN2.8 | X50.14 17.78,25.72 19.05,24.45 v34.29,24.45
  Bottom 0.254: v88.58,26.35 v91.12,26.35 | v34.29,24.45 v69.85,24.45
MOSI  (via drill 0.41)
  Top 0.254: RN2.6 85.72,34.61 87.31,33.02 89.22,33.02 89.53,32.7 89.53,26.04 88.3,24.8 U3.12 77.19,24.8 75.88,23.5 v68.9,23.5 | X50.13 20.32,26.67 21.59,25.4 35.24,25.4 35.88,24.77 v35.88,23.5
  Bottom 0.254: v68.9,23.5 67.63,23.5 67.31,23.81 39.37,23.81 39.05,23.5 v35.88,23.5
N$1
  Top 0.254: J2.5 84.45,44.77 RN2.4
N$2
  pour Top (no thermals): 53.98,70.8 64.45,70.8 65.41,69.85 65.41,68.58 64.45,67.63 60.96,67.63 60.33,66.99 60.33,65.41 59.37,64.45 58.1,64.45 57.15,65.41 57.15,68.26 56.52,68.9 53.98,68.9
N$3
  Top 0.254: R10.2 92.23,19.53 91.6,18.89 81.28,18.89 80.97,19.2 U3.5
N$4  (via drill 0.41)
  Top 0.254: R10.1 v97.16,19.53 97.79,19.53 98.27,19.05 J4.3
  Bottom 0.813: 98.58,19.53 D52.2 v97.16,19.53
N$5
  Top 0.178: U3.4 79.8,18.41
  Top 0.254: R11.2 92.23,17.78 91.6,18.41 79.8,18.41
N$6  (via drill 0.41)
  Top 0.254: R11.1 v97.16,17.78 97.79,17.78 98.26,18.25 J4.2
  Bottom 0.813: v97.16,17.78 D51.2
N$7  (via drill 0.41)
  Top 0.406: v78,20.8 U3.7
  Bottom 0.406: v78,20.8 C54.2
N$8
  Top 0.406: R14.1 D50.A
N$9  (via drill 0.41)
  Bottom 0.813: R50.1 v102.55,17.78 D51.1 D52.1
  pour Top (isolate 0.406, no thermals): 97.79,26.67 106.05,26.67 106.05,11.43 97.79,11.43 97.79,15.24 101.92,15.24 101.92,22.86 97.79,22.86
N$10
  Top 0.406: R8.1 D53.A
N$11
  pour Top (isolate 0.406, no thermals): 29.59,57.09 33.66,57.09 33.66,53.66 32.38,53.66 32.38,55.24 31.75,55.88 29.59,55.88
N$12
  Top 0.406: Q2.1 32.07,52.39 R5.2
N$13
  pour Top: 9.53,19.68 11.3,19.68 11.3,25.84 9.53,25.84
N$14  (via drill 0.41)
  Top 0.406: 15.88,50.93 v17.65,50.93 | 15.88,50.93 R6.2 | Q4.3 11.11,50.93 15.88,50.93
  Top 0.813: Q3.1 21.34,53.04 v21.34,54.36
  Bottom 0.254: v21.34,54.36 18.16,54.36 17.65,53.85 v17.65,50.93
N$15
  Top 0.406: D54.A 52.7,53.34 53.02,53.02 53.02,46.99 52.7,46.67 C11.2
  Top 0.61: X50.28 C11.2 C10.2 | C10.2 X50.18 | R7.2 21.91,48.58 22.23,48.26 22.23,46.99 22.54,46.67 C10.2
  Top 0.813: R7.2 Q3.3
N$17
  Top 0.61: D54.K R2.2
N$18  (via drill 0.41)
  Top 0.254: v94.3,21.27 86.68,21.27 85.41,20 U3.6
  Top 0.406: J4.5 98.41,20.65 97.79,21.27 v97.16,21.27
  Bottom 0.254: v94.3,21.27 v97.16,21.27
  Bottom 0.813: v97.16,21.27 L50.2
N$19
  Top 0.254: J3.6 97.04,40.3 J3.1
N$20
  pour Top (isolate 0.406, no thermals): 30.48,71.75 30.48,67.31 31.75,67.31 32.07,66.99 32.07,64.45 36.83,64.45 36.83,71.75
N$21  (via drill 0.61)
  Top 1.27: D1.A v19.68,61.59
  Bottom 0.813: v19.68,61.59 24.13,61.59 25.4,60.33 v30.48,60.33
  pour Top (isolate 0.406, no thermals): 29.59,61.28 36.83,61.28 36.83,57.78 29.59,57.78
N$22
  Top 0.254: J3.2 92.3,41.68 91.12,42.86 91.12,47.62 90.81,47.94 87.31,47.94 85.72,49.53 RN1.6
N$23
  pour Top (no thermals): 38.73,71.44 38.73,68.26 47.31,68.26 47.31,71.44
N$24
  pour Top (no thermals): 56.04,65.72 56.04,63.82 56.36,63.5 60.17,63.5 61.12,64.45 65.09,64.45 65.09,61.91 53.98,61.91 53.98,65.72
N$25
  Top 0.406: Q4.1 R9.1
N$30
  Top 0.254: C12.2 Y1.1 68.9,36.51 69.22,36.2 71.75,36.2 72.4,35.55 U3.24
N$31
  Top 0.254: J3.7 92.51,43.07 91.76,43.81 91.76,47.94 91.12,48.58 87.95,48.58 87,49.53 RN1.7
N$34
  Top 0.254: U2.6 73.03,58.74 72.71,59.05 72.07,59.05 71.75,59.37 C3.2
N$36
  Top 0.254: U2.2 78.11,59.05 78.42,59.37 79.06,59.37 79.38,59.69 C6.2 R1.1
N$38
  Top 0.254: C13.2 Y1.2 78.42,36.51 78.11,36.2 73.66,36.2 73.2,35.73 U3.23
N$39
  Top 0.254: U2.4 75.56,62.23 75.25,62.55 C4.1
N$44  (via drill 0.41)
  Top 0.254: U2.1 v79.38,58.42 | v76.83,64.14 C5.1
  Bottom 0.254: v79.38,58.42 79.38,60.01 C5.1 v76.83,64.14
N$45
  Top 0.254: U2.5 C4.2
N$46
  Top 0.254: U2.3 C5.2
N$51  (via drill 0.41)
  Top 0.254: J3.8 93.55,45.83 93.03,46.35 93.03,48.58 91.44,50.16 v89.85,50.16 | RN1.5 v84.45,48.9
  Bottom 0.254: v84.45,48.9 86.04,48.9 87.31,50.16 v89.85,50.16
N$71
  Top 0.254: J3.3 93.03,44.45 92.39,45.09 92.39,48.26 91.44,49.21 88.58,49.21 88.27,49.53 RN1.8
N$74
  Top 0.254: U2.13 75.56,49.85 77.15,51.44 81.92,51.44 82.87,52.39 85.41,52.39 85.72,52.7 RN1.3
N$75
  Top 0.254: U2.14 76.83,50.16 77.47,50.8 82.23,50.8 83.19,51.75 87.95,51.75 88.27,52.07 RN1.1
N$101
  Top 0.254: U2.8 70.48,54.61 71.12,53.98 84.45,53.98 RN1.4
N$103
  Top 0.254: R1.2 90.49,62.55 91.12,61.91 91.12,51.44 93.98,48.58 93.98,47.62 94.39,47.22 J3.4
N$104
  Top 0.254: U2.7 71.75,55.24 72.07,54.93 86.68,54.93 87,54.61 RN1.2
N$105
  Top 0.254: J2.1 89.85,46.04 90.17,45.72 90.17,39.37 89.85,39.05 RN2.1
N$107
  Top 0.254: J2.3 87,44.77 RN2.2
N$108
  Top 0.254: RN2.3 J2.4
PBSW  (via drill 0.41)
  Top 0.254: S50.2 65.72,57.86 R4.1 C9.1 65.72,51.36 S50.1 65.76,48.93 62.23,45.4 62.23,29.84 62.87,29.21 64.77,29.21 66.36,27.62 v72.07,27.62 | U3.18 77.2,27.35 75.56,25.72 v72.07,25.72
  Bottom 0.254: v72.07,27.62 v72.07,25.72
PU2
  Top 0.61: X50.17 X50.16 R7.1
RECALL#  (via drill 0.41)
  Top 0.254: U3.40 60.47,22.4 56.2,26.67 56.2,31.11 52.39,34.92 v30.48,34.92
  Bottom 0.254: v30.48,34.92 X50.20
RESET#  (via drill 0.41)
  Top 0.254: RN2.5 84.45,34.29 83.82,33.66 76.68,33.66 75.6,32.58 U3.20 75.6,28.54 75.88,28.26 75.88,27.3 75.25,26.67 67.31,26.67 66.67,26.04 v66.67,17.46 | v52.7,17.46 51.12,17.46 50.8,17.78 44.45,17.78 | 44.45,17.78 J5.6 | 44.45,17.78 33.34,17.78 32.38,16.83 32.38,10.48 31.75,9.84 26.04,9.84 25.72,10.16 R13.1
  Top 0.406: R13.1 C15.1
  Top 0.813: S2.2 R13.1
  Bottom 0.254: v52.7,17.46 53.66,17.46 53.98,17.78 64.77,17.78 65.09,17.46 v66.67,17.46
RTS
  Top 0.254: U3.25 71.6,31.59 69.53,33.66 65.41,33.66 64.77,34.29 64.77,44.13 65.72,45.09 71.44,45.09 71.75,45.4 U2.10
RXD
  Top 0.254: U3.27 70,31.28 68.9,32.38 64.77,32.38 63.5,33.66 63.5,44.77 69.22,50.48 73.98,50.48 74.3,50.16 U2.12
SCLK  (via drill 0.41)
  Top 0.254: RN2.7 87,34.29 87.63,33.66 89.53,33.66 90.17,33.02 90.17,25.72 88.45,24 U3.11 77.66,24 76.2,22.54 v69.85,22.54 | X50.12 22.86,26.99 23.5,26.35 35.56,26.35 37.15,24.77 v37.15,22.54
  Bottom 0.254: v69.85,22.54 67.63,22.54 66.99,23.18 40.01,23.18 39.37,22.54 v37.15,22.54
SS  (via drill 0.41)
  Top 0.254: U3.10 78.13,23.2 76.52,21.59 v68.9,21.59 | X50.11 25.4,27.62 25.72,27.3 35.88,27.3 38.42,24.77 v38.42,21.59
  Bottom 0.254: v68.9,21.59 67.63,21.59 66.67,22.54 40.32,22.54 39.37,21.59 v38.42,21.59 R51.2
STORE#  (via drill 0.41)
  Top 0.254: U3.39 60.62,23.2 56.83,26.99 56.83,31.43 52.7,35.56 32.38,35.56 31.11,36.83 v28.57,36.83
  Bottom 0.254: X50.9 30.48,31.75 28.57,33.66 v28.57,36.83
TCK
  Top 0.254: U3.57 72.4,12.39 69.53,9.53 40.64,9.53 39.69,9.53 39.37,9.84 39.37,10.79 J5.1
  Bottom 0.406: RN50.5 41.91,9.84 41.27,10.48 40.01,10.48 39.37,11.11 J5.1
TDI
  Top 0.254: U3.54 70,12.85 68.58,11.43 52.7,11.43 51.44,12.7 J5.9
  Bottom 0.406: RN50.8 45.72,9.84 46.35,10.48 48.9,10.48 49.53,11.11 J5.9
TDO
  Top 0.254: U3.55 70.8,12.7 68.9,10.79 49.53,10.79 48.58,10.79 48.26,11.11 48.26,12.06 48.26,13.34 47.62,13.97 43.18,13.97 J5.3
  Bottom 0.406: J5.3 41.91,11.43 43.18,10.16 RN50.6
TMS
  Top 0.254: U3.56 71.6,12.54 69.22,10.16 44.77,10.16 44.45,10.48 J5.5
  Bottom 0.406: RN50.7 J5.5
TXD  (via drill 0.41)
  Top 0.254: U3.28 69.2,31.13 68.58,31.75 64.45,31.75 62.87,33.34 62.87,45.09 69.22,51.44 v73.03,51.44 | v73.03,49.53 U2.11
  Bottom 0.254: v73.03,51.44 v73.03,49.53
UID
  Top 0.254: J4.4 98.26,19.85 97.79,20.32 96.84,20.32 94.76,22.4 U3.9
UVCON  (via drill 0.41)
  Top 0.254: U3.2 76.23,16.8 72.39,20.64 v69.85,20.64 | v46.04,20.64 33.66,20.64 30.8,23.5 16.83,23.5 15.88,24.45 v15.88,48.58
  Top 0.406: R5.1 29.21,54.36 23.88,54.36 23.5,53.98 v23.5,48.58
  Bottom 0.254: v69.85,20.64 67.63,20.64 66.36,21.91 49.53,21.91 48.26,20.64 v46.04,20.64 | v15.88,48.58 v23.5,48.58
VBUS  (via drill 0.41)
  Top 0.254: U3.8 81.59,21.6 81.92,21.27 v84.14,21.27
  Top 0.813: 99.38,16.19 v84.14,16.19 84.14,10.79 83.19,9.84 72.87,9.84 70.33,7.3 14.45,7.3 12.86,8.89 12.86,39.69 11.91,40.64 7.62,40.64 5.71,42.55 5.71,63.82 6.67,64.77 20.95,64.77 21.59,64.14 21.59,57.47 | C7.+ Q1.3
  Top 1.676: D2.A 21.59,57.47 C7.+
  Bottom 0.254: v84.14,16.19 v84.14,21.27
  pour Top (isolate 0.406, no thermals): 98.74,17.46 100.65,17.46 100.65,16.99 99.66,16 98.74,16
WE#  (via drill 0.41)
  Top 0.254: U3.41 60.31,21.6 55.56,26.35 55.56,30.8 52.07,34.29 34.92,34.29 34.29,33.66 v33.02,33.66
  Bottom 0.254: v33.02,33.66 X50.21

### Text on the board
Top: TOP SIDE
Bottom: BOTTOM SIDE | KG4LNE
tPlace: RS-232 | 15 | 28 | ISP | LEVER | ZIF | X2444 | X2212 | 8.0 MHZ | MOUNT ZIF OTHER SIDE | 14 | 1 | 1 | 2 | GE-FLASH-USB | X2212/X2444 | PROGRAMMER | JTAG | USB OTG | MADE IN USA
Document: FABRICATION DRAWING | DRILL PLAN | SYM | SIZE | TOL. | CNT | PLATE | 0.016 in | +/-0.003 in | 73 | Yes | 0.024 in | +/-0.003 in | 8 | Yes | 0.032 in | +/-0.003 in | 34 | Yes | 0.036 in | +/-0.003 in | 14 | Yes | 0.040 in | +/-0.003 in | 19 | Yes | 0.056 in | +/-0.003 in | 3 | Yes | 0.066 in | +/-0.003 in | 2 | NO | 0.125 in | +/-0.003 in | 4 | NO | 0.128 in | +/-0.003 in | 2 | Yes | TOTAL | 159 | 153 | NOTES: | 1. PRINTED CIRCUIT BOARD MADE FROM NEMA GRADE FR-4 EPOXY LAMINATE | WITH 0.5 OUNCE COPPER PLATING AND .062 THICKNESS. | 2. ALL DIMENSIONS ARE GIVEN IN INCHES. | 3. CIRCUIT PATHS ARE FOR REFERENCE ONLY. | 4. HOLE SIZES SHOWN ARE FINISHED DIAMETERS AFTER PLATING. | 5. BOARD PLATED USING REFLOW OR SIMILAR METHOD. | 6. APPLY GREEN SOLDER MASK ON PLATED SURFACES USING LIQUID PHOTO IMAGEABLE MASK | OR WET FILM SR1000 EPOXY. EQUIVALENT WET OR DRY FILM MAY BE USED. | 8. THE FOLLOWING INFORMATION APPLIES TO THIS BOARD: | * 2 COPPER LAYERS. | * .062 BOARD THICKNESS. | * SILKSCREEN TOP AND BOTTOM SIDE USING WHITE INK.